# Altium project Holberton.PrjPcb (part 4 of 4)
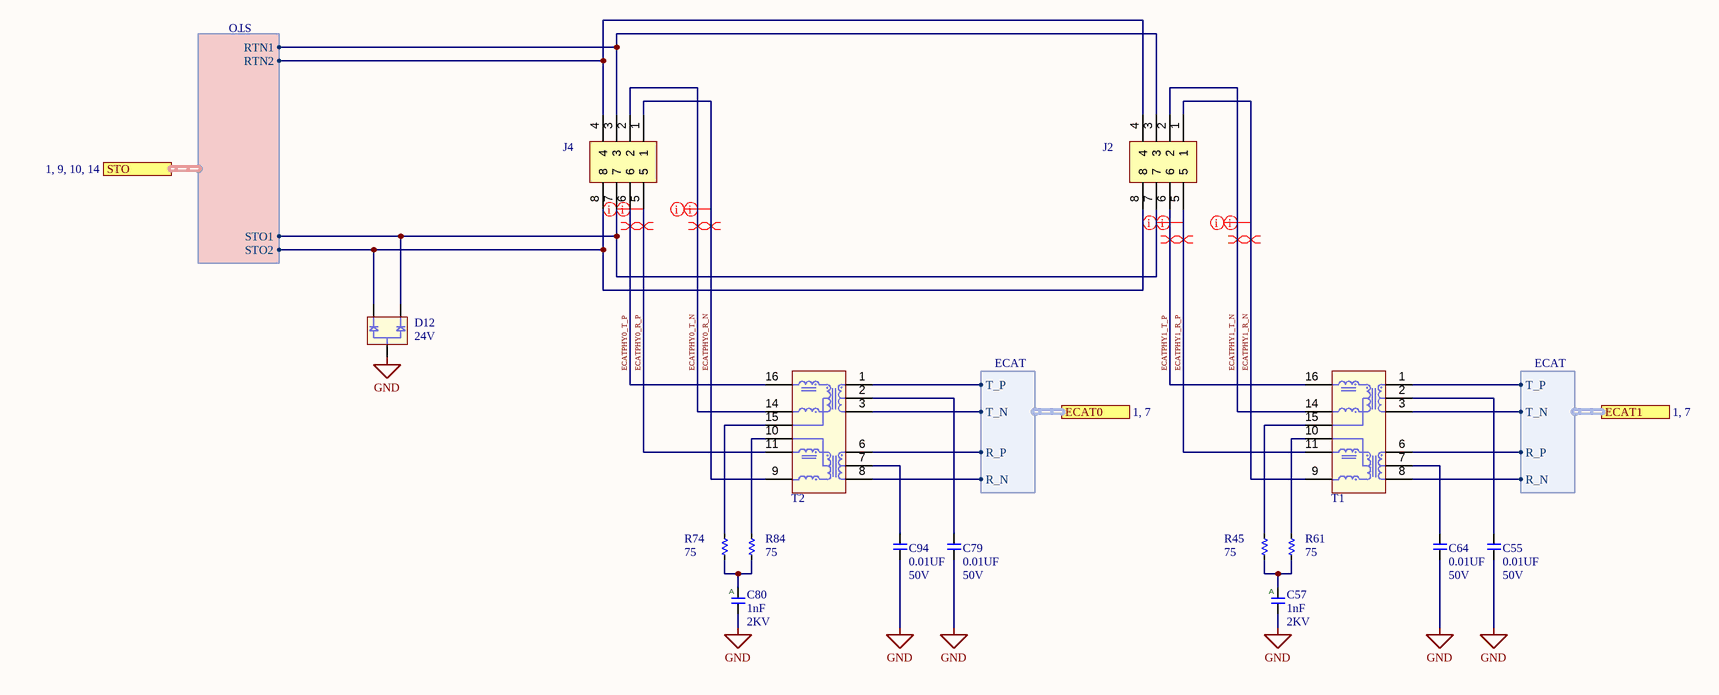
[diagram p14: EtherCATConnectors.SchDoc]

## Nets that join several sheets
3V3: Processor (11 pins), ProcessorSupport (26 pins), Accelerometer (13 pins), Trinamic (25 pins), Power (8 pins), MezzanineConnectors_Cortes (5 pins)
3V3A: ProcessorSupport (FB3.7 FB3.8), Power (6 pins), Temperature (10 pins), 1-Holberton_Child_Top (C168.1 FB4.1)
3V3A_GB: 1-Holberton_Child_Top (C169.1 C170.1 FB4.2), Feedback (11 pins), Drive (5 pins)
24V0_GB: 1-Holberton_Child_Top (C15.1 FB1.2), Drive (C16.1 R8.2), STO (Q1.S R34.2 R36.2)
AGND: 1-Holberton_TOP (TP12.1), ProcessorSupport (6 pins), Power (6 pins), Temperature (15 pins), MezzanineConnectors_Cortes (D24.A J5.2), 1-Holberton_Child_Top (C168.2 C169.2 C170.2), Feedback (22 pins), Drive (10 pins)
GND: 1-Holberton_TOP (7 pins), Processor (35 pins), ProcessorSupport (64 pins), Accelerometer (15 pins), Trinamic (51 pins), Power (24 pins), MezzanineConnectors_Cortes (8 pins), 1-Holberton_Child_Top (9 pins), Feedback (12 pins), Drive (25 pins), mezz/Holberton_Child/driver/PHA (5 pins), mezz/Holberton_Child/driver/PHB (5 pins), mezz/Holberton_Child/driver/PHC (5 pins), STO (12 pins), EtherCATConnectors (7 pins)
MPWR: Feedback (R134.1), Drive (11 pins), mezz/Holberton_Child/driver/PHA (C31_PHA.1 C37_PHA.1 Q11_PHA.5 R23_PHA.2), mezz/Holberton_Child/driver/PHB (C31_PHB.1 C37_PHB.1 Q11_PHB.5 R23_PHB.2), mezz/Holberton_Child/driver/PHC (C31_PHC.1 C37_PHC.1 Q11_PHC.5 R23_PHC.2)
MPWR_IN: 1-Holberton_Child_Top (C161.1 C162.1 D11.K M4.1), Drive (7 pins)
24V0: Power (6 pins), MezzanineConnectors_Cortes (J1.6 J1.8), 1-Holberton_Child_Top (C14.1 FB1.1)
24V0_SAFE: Drive (C25.1 C26.1 U11.5), STO (Q2.D R33.2 R42.2)
24V0_SAFE_ADC: Processor (U6.P1), STO (C54.1 R39.2 R42.1)
AGM_CLK: Processor (U6.P12), Accelerometer (U8.13)
AGM_CS_AG: Processor (U6.R12), Accelerometer (R89.2 U8.12)
AGM_INT1_AG: Processor (U6.B4), Accelerometer (U8.4)
AGM_INT2_AG: Processor (U6.C4), Accelerometer (U8.9)
AGM_INT_M: Processor (U6.N8), Accelerometer (U9.7)
AGM_MISO: Processor (U6.P13), Accelerometer (U8.1)
AGM_MOSI: Processor (U6.M12), Accelerometer (U8.14)
BOOT0: Processor (D15.K J3.19 R5.2 U6.C5), Trinamic (R69.2)
BUS_VOLTAGE_ADC: Processor (U6.R10), Feedback (C152.1 R144.2 TP10.1)
DRIVE_THERM: Temperature (C157.1 R148.1 U14.12), Drive (R21.1)
DRIVE_THERM_ADC: Processor (U6.K3), Temperature (C158.1 R150.2)
ECAT_LATCH_IN0: Processor (U6.J15), Trinamic (U5.C7)
ECAT_LATCH_IN1: Processor (U6.B5), Trinamic (U5.C6)
ECAT_MFC_CS: Processor (U6.B10), Trinamic (U5.D4)
ECAT_MFCIO_0: Processor (U6.D9), Trinamic (U5.J8)
ECAT_MFCNES: Processor (U6.L13), Trinamic (U5.C5)
ECAT_PDI_CLK: Processor (U6.P15), Trinamic (U5.K3)
ECAT_PDI_CS: Processor (U6.R5), Trinamic (U5.L4)
ECAT_PDI_EOF: Processor (U6.P10), Trinamic (U5.G3)
ECAT_PDI_IRQ: Processor (U6.M15), Trinamic (U5.J3)
ECAT_PDI_MISO: Processor (U6.M11), Trinamic (U5.K5)
ECAT_PDI_MOSI: Processor (U6.J4), Trinamic (U5.L5)
ECAT_PDI_SOF: Processor (U6.N12), Trinamic (U5.H3)
ECAT_PROM_INIT: Processor (U6.C13), Trinamic (U5.J5)
ECAT_R0_N: Trinamic (U5.A1), EtherCATConnectors (T2.8)
ECAT_R0_P: Trinamic (U5.B1), EtherCATConnectors (T2.6)
ECAT_R1_N: Trinamic (U5.G1), EtherCATConnectors (T1.8)
ECAT_R1_P: Trinamic (U5.H1), EtherCATConnectors (T1.6)
ECAT_RESET: Processor (U6.E13), Trinamic (R163.2)
ECAT_RESET_OUT: Processor (R94.1 U6.B9), Trinamic (R27.2 U5.J4)
ECAT_SYNC_OUT0: Processor (U6.H14), Trinamic (U5.D7)
ECAT_SYNC_OUT1: Processor (U6.J12), Trinamic (U5.D6)
ECAT_T0_N: Trinamic (U5.D1), EtherCATConnectors (T2.3)
ECAT_T0_P: Trinamic (U5.E1), EtherCATConnectors (T2.1)
ECAT_T1_N: Trinamic (U5.K1), EtherCATConnectors (T1.3)
ECAT_T1_P: Trinamic (U5.L1), EtherCATConnectors (T1.1)
ECAT_WD_STATE: Processor (R98.2 U6.L14), Trinamic (U5.G4)
ECAT_WD_TRIG: Processor (U6.K13), Trinamic (U5.F4)
ENC_A: Processor (U6.N14), MezzanineConnectors_Cortes (U19.2)
ENC_B: Processor (U6.N15), MezzanineConnectors_Cortes (U19.6)
ENC_CLK: Processor (U6.C12), MezzanineConnectors_Cortes (U19.12)
ENC_CS: Processor (U6.P5), MezzanineConnectors_Cortes (R122.1 U19.5)
ENC_MISO: Processor (U6.C11), MezzanineConnectors_Cortes (R123.1 U19.7)
ENC_MOSI: Processor (U6.B11), MezzanineConnectors_Cortes (U19.4)
ENC_THERM_ADC: Processor (U6.H4), Temperature (C96.1 R81.2)
ENC_Z: Processor (U6.N13), MezzanineConnectors_Cortes (U19.3)
FB_STO1: Processor (U6.G14), STO (C56.1 R43.1 R46.2)
FB_STO2: Processor (U6.F15), STO (C58.1 R47.1 R51.2)
FSOE_STO1: Processor (U6.G15), STO (Q4.1 R55.2)
FSOE_STO2: Processor (R97.1 R98.1), STO (Q3.1 R54.2)
GD_CLK: Processor (U6.B7), Drive (U11.31)
GD_CS: Processor (U6.G12), Drive (U11.32)
GD_FAULT_L: Processor (U6.F14), MezzanineConnectors_Cortes (R83.1), Drive (U11.28)
GD_MISO: Processor (R80.1 U6.D8), Drive (U11.29)
GD_MOSI: Processor (U6.C7), Drive (U11.30)
GD_PWM_EN: Processor (U6.G13), Drive (U11.33)
GD_PWM_HA: Processor (U6.E14), Drive (U11.34)
GD_PWM_HB: Processor (U6.D14), Drive (U11.36)
GD_PWM_HC: Processor (U6.D13), Drive (U11.38)
GD_PWM_LA: Processor (U6.D15), Drive (U11.35)
GD_PWM_LB: Processor (U6.B14), Drive (U11.37)
GD_PWM_LC: Processor (U6.C14), Drive (U11.39)
GHA: Drive (U11.8), mezz/Holberton_Child/driver/PHA (Q11_PHA.4)
GHB: Drive (U11.17), mezz/Holberton_Child/driver/PHB (Q11_PHB.4)
GHC: Drive (U11.18), mezz/Holberton_Child/driver/PHC (Q11_PHC.4)
GLA: Drive (U11.10), mezz/Holberton_Child/driver/PHA (Q8_PHA.4)
GLB: Drive (U11.15), mezz/Holberton_Child/driver/PHB (Q8_PHB.4)
GLC: Drive (U11.20), mezz/Holberton_Child/driver/PHC (Q8_PHC.4)
IA_ADC: Processor (U6.R3), Feedback (C153.1 R151.2 TP4.1)
IB_ADC: Processor (U6.P3), Feedback (C154.1 R152.2 TP9.1)
IC_ADC: Processor (U6.N7), Feedback (C171.1 R158.2 TP11.1)
MFCIO_SCL: Processor (U6.A2), Trinamic (R60.1 R64.2)
MFCIO_SDA: Processor (U6.B3), Trinamic (R59.1 R63.2)
MOTOR_CURRENT_ADC: Processor (U6.N11), Drive (C173.1 R159.2 TP8.1)
MOTOR_THERM1: Temperature (C165.1 R156.1 U14.3), 1-Holberton_Child_Top (FB8.2)
MOTOR_THERM1_ADC: Processor (U6.N2), Temperature (C166.1 R155.2)
MOTOR_THERM2: Temperature (C164.1 R154.1 U14.5), 1-Holberton_Child_Top (FB7.2)
MOTOR_THERM2_ADC: Processor (U6.J3), Temperature (C163.1 R153.2)
MOTOR_THERM3: Temperature (C156.1 R149.1 U14.10), 1-Holberton_Child_Top (FB6.2)
MOTOR_THERM3_ADC: Processor (U6.H3), Temperature (C155.1 R147.2)
NetC90_1: Temperature (C90.1 R87.1 U17.3), MezzanineConnectors_Cortes (D24.K FB5.1)
PHASE_V_ADC_A: Processor (U6.R7), Feedback (C151.1 R145.2 TP6.1)
PHASE_V_ADC_B: Processor (U6.R6), Feedback (C127.1 R112.2 TP5.1)
PHASE_V_ADC_C: Processor (U6.M8), Feedback (C132.1 R116.2 TP7.1)
PHASEA: Feedback (R131.1 R160.1 U13.8), Drive (U11.9), mezz/Holberton_Child/driver/PHA (C41_PHA.1 Q8_PHA.5 Q11_PHA.1 R26_PHA.2)
PHASEA_OUT: 1-Holberton_Child_Top (M7.1), Feedback (R160.2 U13.1)
PHASEB: Feedback (R125.1 R162.1 U12.8), Drive (U11.16), mezz/Holberton_Child/driver/PHB (C41_PHB.1 Q8_PHB.5 Q11_PHB.1 R26_PHB.2)
PHASEB_OUT: 1-Holberton_Child_Top (M8.1), Feedback (R162.2 U12.1)
PHASEC: Feedback (R126.1 R161.1 U16.8), Drive (U11.19), mezz/Holberton_Child/driver/PHC (C41_PHC.1 Q8_PHC.5 Q11_PHC.1 R26_PHC.2)
PHASEC_OUT: 1-Holberton_Child_Top (M6.1), Feedback (R161.2 U16.1)
SNA: Drive (U11.12), mezz/Holberton_Child/driver/PHA (NT3_PHA.1)
SNB: Drive (U11.13), mezz/Holberton_Child/driver/PHB (NT3_PHB.1)
SNC: Drive (U11.22), mezz/Holberton_Child/driver/PHC (NT3_PHC.1)
STO1: MezzanineConnectors_Cortes (J1.7), STO (R58.2), EtherCATConnectors (D12.1 J2.7 J4.7)
STO2: MezzanineConnectors_Cortes (J1.5), STO (R57.1), EtherCATConnectors (D12.2 J2.8 J4.8)
STO_RET1: MezzanineConnectors_Cortes (J1.1), STO (U2.2), EtherCATConnectors (J2.3 J4.3)
STO_RET2: MezzanineConnectors_Cortes (J1.3), STO (U1.2), EtherCATConnectors (J2.4 J4.4)
VDS_A_ADC: Processor (U6.M2), Drive (C19.1 R14.1)
VDS_B_ADC: Processor (U6.R8), Drive (C21.1 R15.1)
VDS_C_ADC: Processor (U6.P11), Drive (C23.1 R19.1)

## Assembly variants
PCBA: not fitted J5 R1 R10 R24 R26_PHA R26_PHB R26_PHC R98 R146 U7